# EAGLE schematic display_prog (EAGLE 6.1)
APVD: B.F; DOC_ID: CLK-SCH-51; DOC_PART_NO: CLK-PC-01-PROG; DOC_REV: A; DOC_TITLE: LED matrix PIC programmer adapter; PROJECT_NAME: Alarm clock
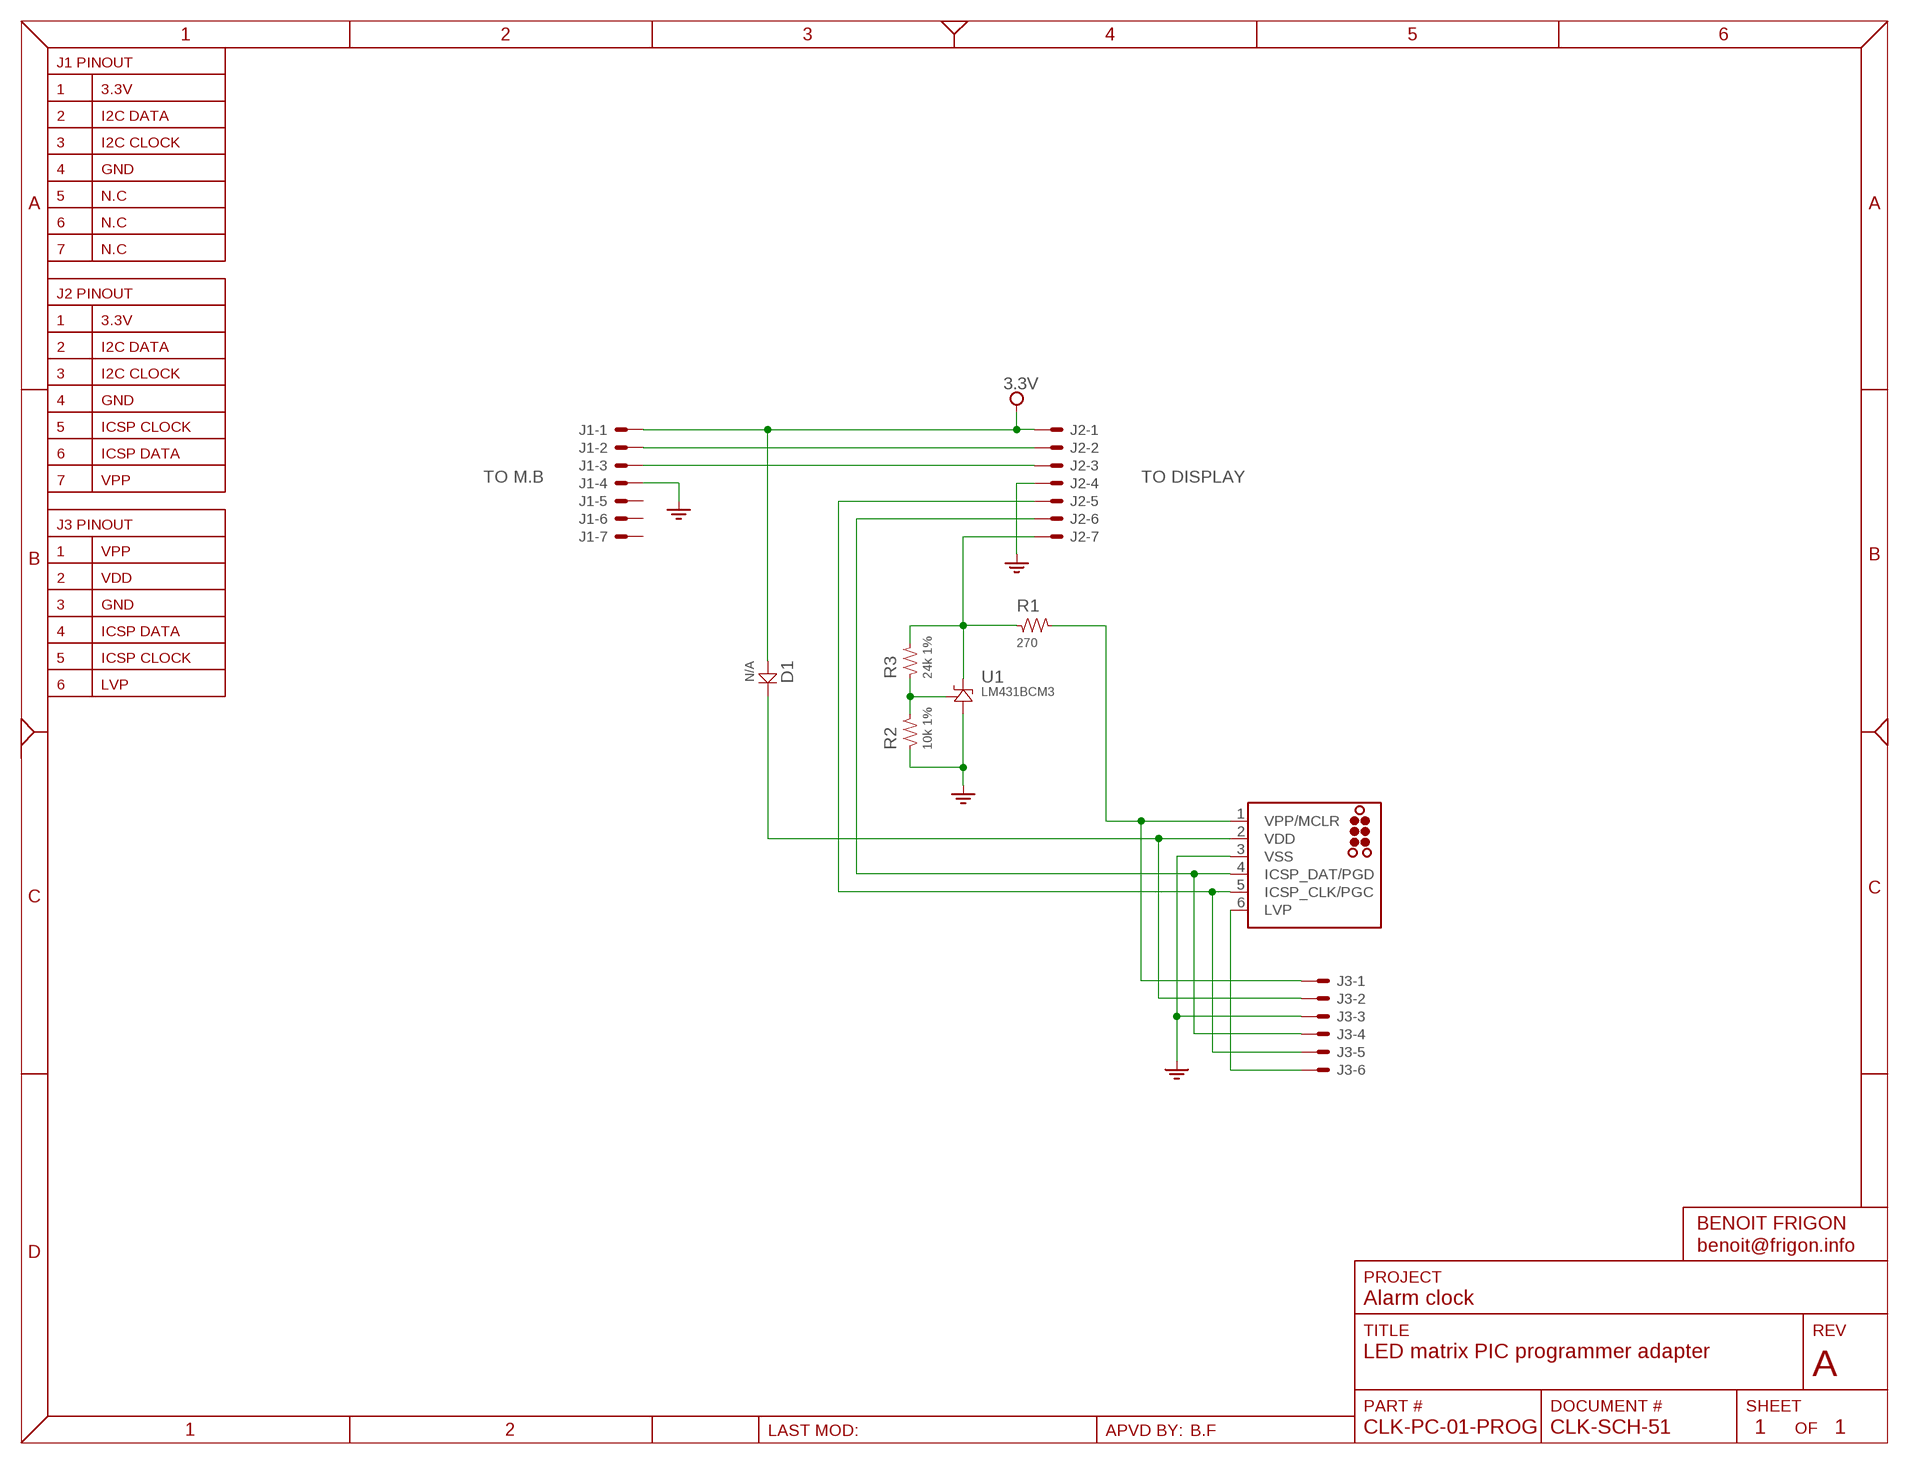
[diagram p0: schematic, sheet 1]

## Parts
D1  N/A  DIODE-0603  [DIODE_0603]
J1  SNG-2MM-HEADER-07-V  [DF3X-7P-2DSA]
J2  SNG-2MM-HEADER-07-V  [DF3X-7P-2DSA]
J3  SNG-100-HEADER-06-FL-V  [22-23-2061]
J4  TC2030-MCP  [TC2030-MCP]
R1  270  RES-0603  [SMD_0603]
R2  10k 1%  RES-0603  [SMD_0603]
R3  24k 1%  RES-0603  [SMD_0603]
U1  LM431BCM3  [SOT23]

## Nets
3.3V: D1.A J1.1 J2.1
GND: J1.4 J2.4 J3.3 J4.3(VSS) R2.1 U1.3(A)
ICSP-CLK: J2.5 J3.5 J4.5(ICSP_CLK/PGC)
ICSP-DAT: J2.6 J3.4 J4.4(ICSP_DAT/PGD)
N$7: J3.1 J4.1(VPP/MCLR) R1.2
N$8: R2.2 R3.1 U1.2(ADJ)
N$9: J2.7 R1.1 R3.2 U1.1(K)
N$10: J3.6 J4.6(LVP)
SCL: J1.3 J2.3
SDA: J1.2 J2.2
VDD_MON: D1.K J3.2 J4.2(VDD)
Unconnected: J1.5 J1.6 J1.7

## Notes on the sheet
- TO M.B | TO DISPLAY

## Library data of the parts
D1 = Passive:DIODE: Diode; DESCRIPTION: {DESCRIPTION} - SMT 0603 - {VALUE}; PACKAGE: SMT 0603; SKU: {VALUE}
J1 J2 = Connectors:SNG-2MM-HEADER-07: 2mm Single Row Header - 7 pos; DESCRIPTION: {DESCRIPTION} - SMT Vertical; MFG: Hirose Electronic; SKU: DF3X-7P-2DSA
J3 = Connectors:SNG-100-HEADER-06: 6 Pos - Single Row - 2.54mm header; DESCRIPTION: {DESCRIPTION} - Vertical; MFG: Molex; SKU: 22-23-2061
J4 = Connectors:TC2030: TAG-CONNECT ISP Connector Manufacturer: Tag-Connect <www.tag-connect.com> Cable for easy In-Circuit PCB Programming. Designed for Microchip ICD2, suitable for many others. Two variants - one "with legs" (for hads-free fit on PCB) and another "without legs" for quick programming. PAD Description 1 MCLR/Vpp 2 Vdd 3 GND 4 PGD (ISPDAT) 5 PGC (ISPCLK) 6 nc (used for LVP) ©2009 ROFA.cz; BOM: 0; MFG: Tag-Connect
R1-R3 = Passive:RES: Resistor; DESCRIPTION: {DESCRIPTION} - SMT 0603 - {VALUE}; PACKAGE: SMT 0603
U1 = Passive:LM431*?: Adjustable presision zenner shunt; DESCRIPTION: {DESCRIPTION} - 1% tolerance; MFG: Texas Instruments; PRICE: 0.79; SKU: LM431BCM3/NOPBCT-ND; SUPPLIER: Digi-Key